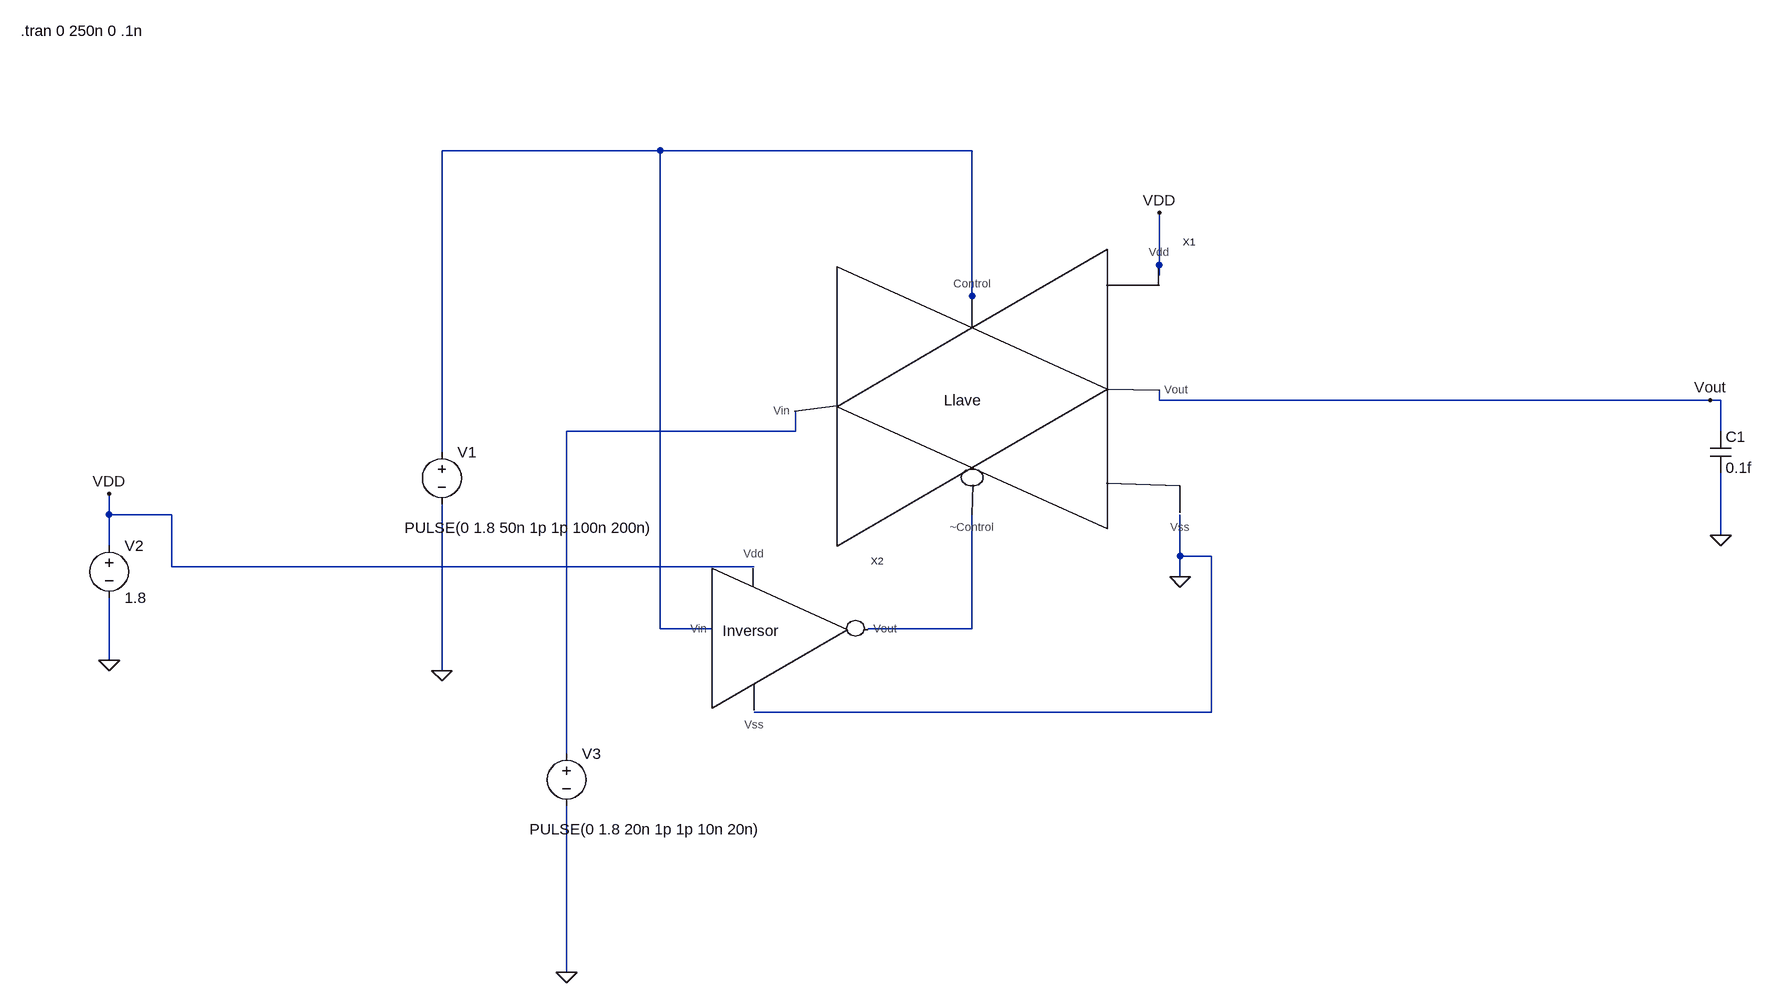
[diagram p0: schematic TRANSGATE_TB.asc]
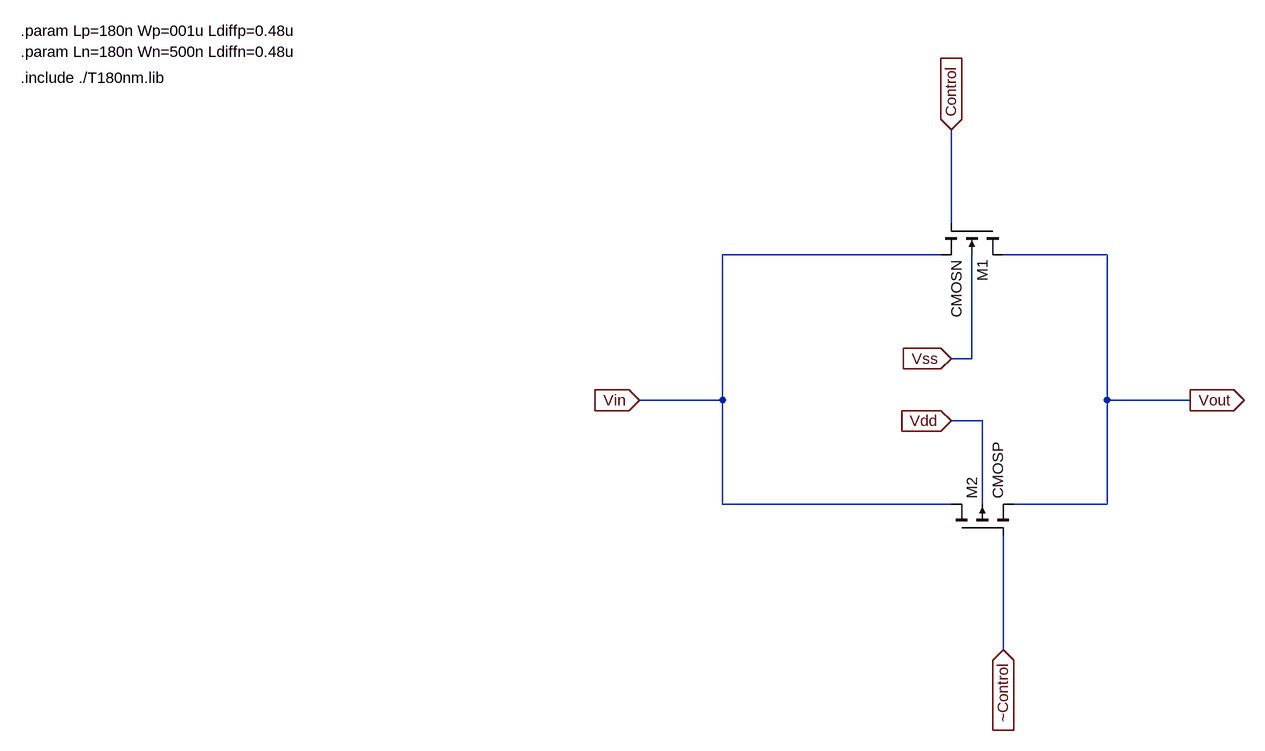
[diagram p1: sub-circuit transgate.asc]
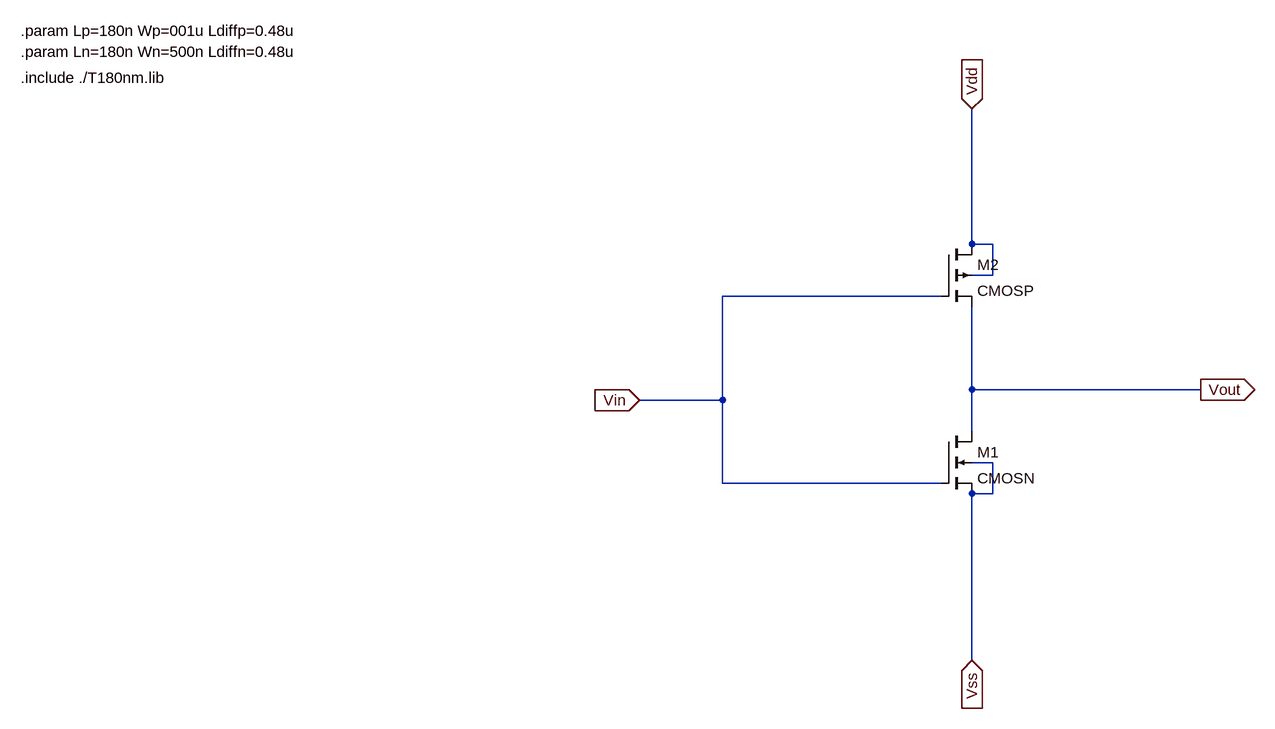
[diagram p2: sub-circuit inversor.asc]
TRANSGATE_TB.asc, the LTspice schematic file:
Version 4
SHEET 1 1432 1476
WIRE -256 -272 -592 -272
WIRE 224 -272 -256 -272
WIRE 512 -96 512 -176
WIRE 512 -80 512 -96
WIRE 224 -48 224 -272
WIRE 224 -32 224 -48
WIRE 512 112 512 96
WIRE 1360 112 512 112
WIRE 1376 112 1360 112
WIRE -48 160 -48 128
WIRE -48 160 -400 160
WIRE 1376 160 1376 112
WIRE -592 192 -592 -272
WIRE -1104 288 -1104 256
WIRE -1008 288 -1104 288
WIRE 1376 320 1376 224
WIRE -1104 336 -1104 288
WIRE 544 352 544 288
WIRE 592 352 544 352
WIRE -1008 368 -1008 288
WIRE -112 368 -1008 368
WIRE 544 384 544 352
WIRE -256 464 -256 -272
WIRE -176 464 -256 464
WIRE 224 464 224 288
WIRE 224 464 64 464
WIRE -1104 512 -1104 416
WIRE -592 528 -592 272
WIRE 592 592 592 352
WIRE 592 592 -112 592
WIRE -400 656 -400 160
WIRE -400 992 -400 736
FLAG 544 384 0
FLAG 512 -176 VDD
FLAG -1104 512 0
FLAG -592 528 0
FLAG -1104 256 VDD
FLAG 1360 112 Vout
FLAG 1376 320 0
FLAG -400 992 0
SYMBOL voltage -592 176 R0
WINDOW 3 -57 132 Left 2
WINDOW 123 0 0 Left 2
WINDOW 39 0 0 Left 2
SYMATTR Value PULSE(0 1.8 50n 1p 1p 100n 200n)
SYMATTR InstName V1
SYMBOL voltage -1104 320 R0
WINDOW 123 0 0 Left 2
WINDOW 39 0 0 Left 2
SYMATTR InstName V2
SYMATTR Value 1.8
SYMBOL transgate 208 112 R0
SYMATTR InstName X1
SYMBOL inversor -112 464 R0
SYMATTR InstName X2
SYMBOL cap 1360 160 R0
SYMATTR InstName C1
SYMATTR Value 0.1f
SYMBOL voltage -400 640 R0
WINDOW 3 -57 132 Left 2
WINDOW 123 0 0 Left 2
WINDOW 39 0 0 Left 2
SYMATTR Value PULSE(0 1.8 20n 1p 1p 10n 20n)
SYMATTR InstName V3
TEXT -1240 -456 Left 2 !.tran 0 250n 0 .1n

transgate.asc, the sub-circuit schematic file:
Version 4
SHEET 1 880 712
WIRE 192 -128 192 -272
WIRE 176 -80 -160 -80
WIRE 432 -80 272 -80
WIRE 224 80 224 -80
WIRE 224 80 192 80
WIRE -160 144 -160 -80
WIRE -160 144 -288 144
WIRE 432 144 432 -80
WIRE 560 144 432 144
WIRE 240 176 192 176
WIRE -160 304 -160 144
WIRE 192 304 -160 304
WIRE 240 304 240 176
WIRE 432 304 432 144
WIRE 432 304 288 304
WIRE 272 528 272 352
FLAG -288 144 Vin
IOPIN -288 144 In
FLAG 560 144 Vout
IOPIN 560 144 Out
FLAG 192 -272 Control
IOPIN 192 -272 In
FLAG 272 528 ~Control
IOPIN 272 528 In
FLAG 192 176 Vdd
IOPIN 192 176 In
FLAG 192 80 Vss
IOPIN 192 80 In
SYMBOL nmos4 272 -128 R90
SYMATTR InstName M1
SYMATTR Value CMOSN
SYMATTR Value2 l={Ln} w={Wn} ad={Ldiffn*Wn} as={Ldiffn*Wn} pd={2*Ldiffn+Wn} ps={2*Ldiffn+Wn}
SYMBOL pmos4 192 352 R270
SYMATTR InstName M2
SYMATTR Value CMOSP
SYMATTR Value2 l={Lp} w={Wp} ad={Ldiffp*Wp} as={Ldiffp*Wp} pd={2*Ldiffp+Wp} ps={2*Ldiffp+Wp}
TEXT -1240 -352 Left 2 !.include ./T180nm.lib
TEXT -1240 -424 Left 2 !.param Lp=180n Wp=001u Ldiffp=0.48u
TEXT -1240 -392 Left 2 !.param Ln=180n Wn=500n Ldiffn=0.48u

inversor.asc, the sub-circuit schematic file:
Version 4
SHEET 1 880 712
WIRE 224 -96 224 -304
WIRE 256 -96 224 -96
WIRE 256 -48 256 -96
WIRE 256 -48 224 -48
WIRE 176 -16 -160 -16
WIRE 224 128 224 0
WIRE 576 128 224 128
WIRE -160 144 -160 -16
WIRE -160 144 -288 144
WIRE 224 192 224 128
WIRE 256 240 224 240
WIRE -160 272 -160 144
WIRE 176 272 -160 272
WIRE 256 288 256 240
WIRE 256 288 224 288
WIRE 224 544 224 288
FLAG -288 144 Vin
IOPIN -288 144 In
FLAG 576 128 Vout
IOPIN 576 128 Out
FLAG 224 -304 Vdd
IOPIN 224 -304 In
FLAG 224 544 Vss
IOPIN 224 544 In
SYMBOL nmos4 176 192 R0
SYMATTR InstName M1
SYMATTR Value CMOSN
SYMATTR Value2 l={Ln} w={Wn} ad={Ldiffn*Wn} as={Ldiffn*Wn} pd={2*Ldiffn+Wn} ps={2*Ldiffn+Wn}
SYMBOL pmos4 176 -96 R0
SYMATTR InstName M2
SYMATTR Value CMOSP
SYMATTR Value2 l={Lp} w={Wp} ad={Ldiffp*Wp} as={Ldiffp*Wp} pd={2*Ldiffp+Wp} ps={2*Ldiffp+Wp}
TEXT -1240 -352 Left 2 !.include ./T180nm.lib
TEXT -1240 -424 Left 2 !.param Lp=180n Wp=001u Ldiffp=0.48u
TEXT -1240 -392 Left 2 !.param Ln=180n Wn=500n Ldiffn=0.48u

The netlist it stands for:
* TRANSGATE_TB.asc
V1 N001 0 PULSE(0 1.8 50n 1p 1p 100n 200n)
V2 VDD 0 1.8
XX1 N002 VDD 0 Vout N001 N003 transgate
XX2 N001 VDD 0 N003 inversor
C1 Vout 0 0.1f
V3 N002 0 PULSE(0 1.8 20n 1p 1p 10n 20n)

* block symbol definitions
.subckt transgate Vin Vdd Vss Vout Control ~Control
M1 Vout Control Vin Vss CMOSN l={Ln} w={Wn} ad={Ldiffn*Wn} as={Ldiffn*Wn} pd={2*Ldiffn+Wn} ps={2*Ldiffn+Wn}
M2 Vin ~Control Vout Vdd CMOSP l={Lp} w={Wp} ad={Ldiffp*Wp} as={Ldiffp*Wp} pd={2*Ldiffp+Wp} ps={2*Ldiffp+Wp}
.include ./T180nm.lib
.param Lp=180n Wp=001u Ldiffp=0.48u
.param Ln=180n Wn=500n Ldiffn=0.48u
.ends transgate

.subckt inversor Vin Vdd Vss Vout
M1 Vout Vin Vss Vss CMOSN l={Ln} w={Wn} ad={Ldiffn*Wn} as={Ldiffn*Wn} pd={2*Ldiffn+Wn} ps={2*Ldiffn+Wn}
M2 Vdd Vin Vout Vdd CMOSP l={Lp} w={Wp} ad={Ldiffp*Wp} as={Ldiffp*Wp} pd={2*Ldiffp+Wp} ps={2*Ldiffp+Wp}
.include ./T180nm.lib
.param Lp=180n Wp=001u Ldiffp=0.48u
.param Ln=180n Wn=500n Ldiffn=0.48u
.ends inversor

.model NMOS NMOS
.model PMOS PMOS
.lib standard.mos
.tran 0 250n 0 .1n
.backanno
.end